# EAGLE schematic footprints (EAGLE 9.6.2)
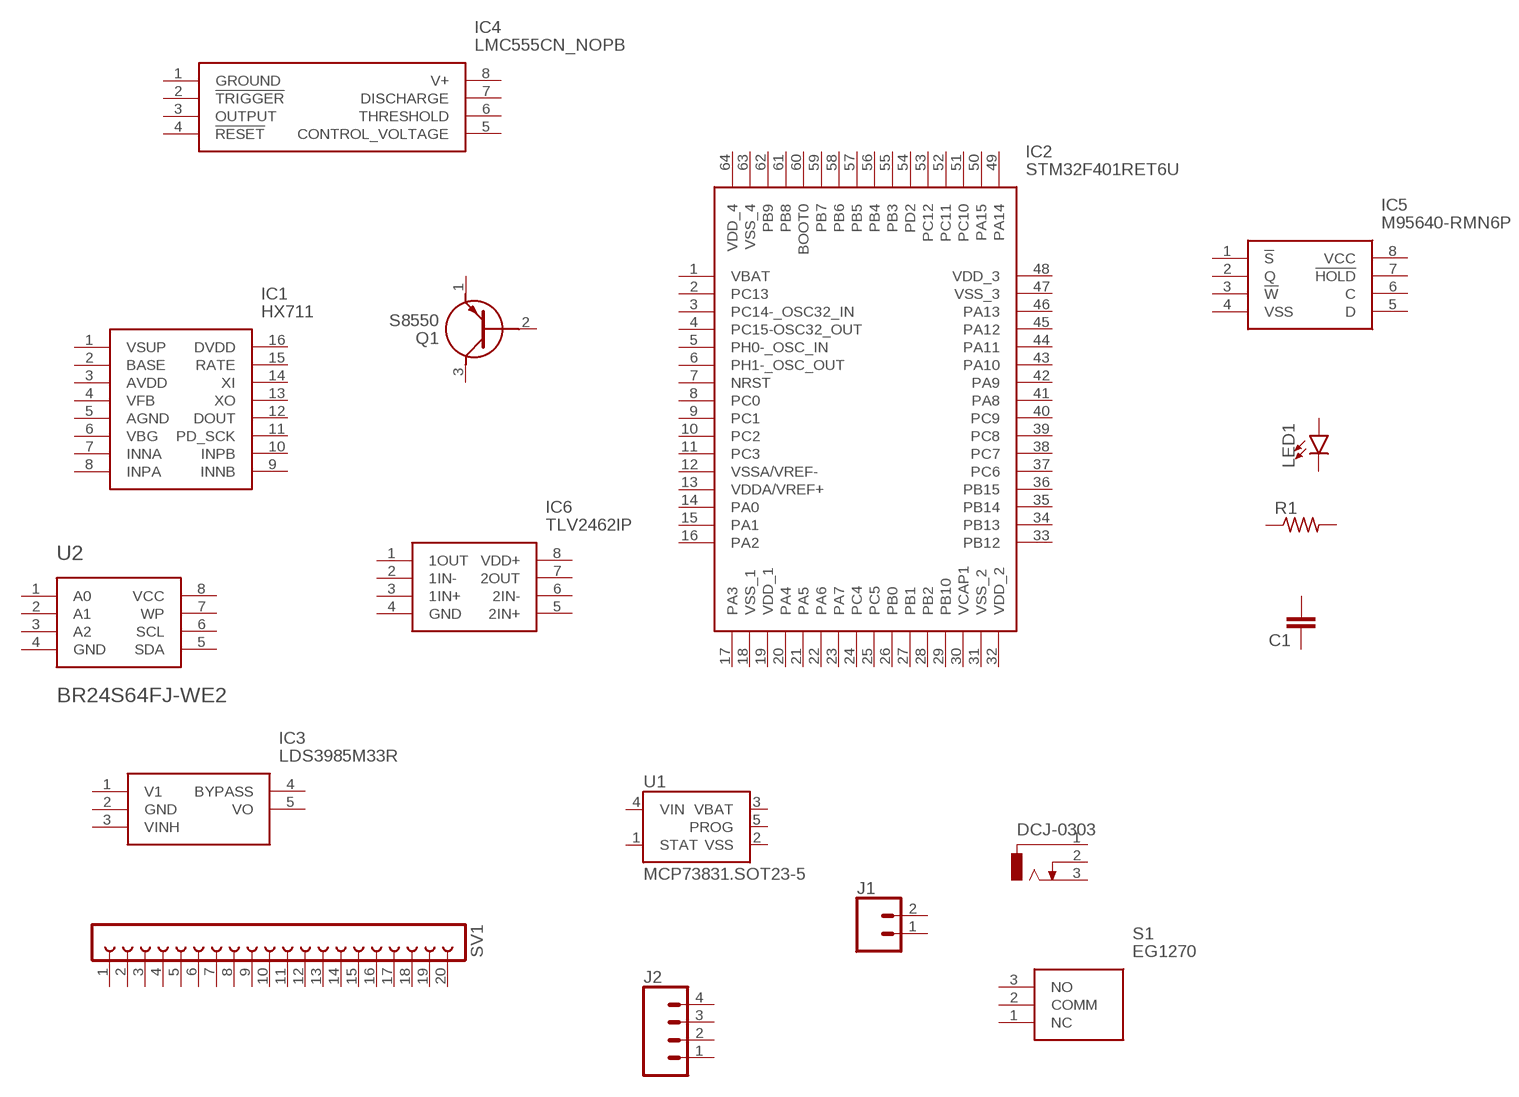
[diagram p0: schematic, sheet 1]

## Parts
C1  CAPACITOR0603  [C0603]
DCJ-0303  DCJ0303  [DCJ0303]
IC1  HX711  [SOIC127P600X160-16N]
IC2  STM32F401RET6U  [QFP50P1200X1200X160-64N]
IC3  LDS3985M33R  [SOT95P280X145-5N]
IC4  LMC555CN_NOPB  [DIP794W53P254L959H508Q8N]
IC5  M95640-RMN6P  [SOIC127P600X175-8N]
IC6  TLV2462IP  [DIP794W53P254L959H508Q8N]
J1  CONN_02  [1X02]
J2  CONN_04  [1X04]
LED1  LED0603  [LED-0603]
Q1  S8550  [MJE13001TP]
R1  RESISTOR0603  [R0603]
S1  EG1270  [EG1270]
SV1  FE20-1  [FE20]
U1  MCP73831.SOT23-5  [SOT23-5]
U2  BR24S64FJ-WE2  [SOIC8]
Unconnected: C1.1 C1.2 DCJ-0303.1 DCJ-0303.2 DCJ-0303.3 IC1.1(VSUP) IC1.2(BASE) IC1.3(AVDD) IC1.4(VFB) IC1.5(AGND) IC1.6(VBG) IC1.7(INNA) IC1.8(INPA) IC1.9(INNB) IC1.10(INPB) IC1.11(PD_SCK) IC1.12(DOUT) IC1.13(XO) IC1.14(XI) IC1.15(RATE) IC1.16(DVDD) IC2.1(VBAT) IC2.2(PC13) IC2.3(PC14-_OSC32_IN) IC2.4(PC15-OSC32_OUT) IC2.5(PH0-_OSC_IN) IC2.6(PH1-_OSC_OUT) IC2.7(NRST) IC2.8(PC0) IC2.9(PC1) IC2.10(PC2) IC2.11(PC3) IC2.12(VSSA/VREF-) IC2.13(VDDA/VREF+) IC2.14(PA0) IC2.15(PA1) IC2.16(PA2) IC2.17(PA3) IC2.18(VSS_1) IC2.19(VDD_1) IC2.20(PA4) IC2.21(PA5) IC2.22(PA6) IC2.23(PA7) IC2.24(PC4) IC2.25(PC5) IC2.26(PB0) IC2.27(PB1) IC2.28(PB2) IC2.29(PB10) IC2.30(VCAP1) IC2.31(VSS_2) IC2.32(VDD_2) IC2.33(PB12) IC2.34(PB13) IC2.35(PB14) IC2.36(PB15) IC2.37(PC6) IC2.38(PC7) IC2.39(PC8) IC2.40(PC9) IC2.41(PA8) IC2.42(PA9) IC2.43(PA10) IC2.44(PA11) IC2.45(PA12) IC2.46(PA13) IC2.47(VSS_3) IC2.48(VDD_3) IC2.49(PA14) IC2.50(PA15) IC2.51(PC10) IC2.52(PC11) IC2.53(PC12) IC2.54(PD2) IC2.55(PB3) IC2.56(PB4) IC2.57(PB5) IC2.58(PB6) IC2.59(PB7) IC2.60(BOOT0) IC2.61(PB8) IC2.62(PB9) IC2.63(VSS_4) IC2.64(VDD_4) IC3.1(V1) IC3.2(GND) IC3.3(VINH) IC3.4(BYPASS) IC3.5(VO) IC4.1(GROUND) IC4.2(!TRIGGER) IC4.3(OUTPUT) IC4.4(!RESET) IC4.5(CONTROL_VOLTAGE) IC4.6(THRESHOLD) IC4.7(DISCHARGE) IC4.8(V+) IC5.1(!S) IC5.2(Q) IC5.3(!W) IC5.4(VSS) IC5.5(D) IC5.6(C) IC5.7(!HOLD) IC5.8(VCC) IC6.1(1OUT) IC6.2(1IN-) IC6.3(1IN+) IC6.4(GND) IC6.5(2IN+) IC6.6(2IN-) IC6.7(2OUT) IC6.8(VDD+) J1.1 J1.2 J2.1 J2.2 J2.3 J2.4 LED1.A LED1.C Q1.1(E) Q1.2(B) Q1.3(C) R1.1 R1.2 S1.1(NC) S1.2(COMM) S1.3(NO) SV1.1 SV1.2 SV1.3 SV1.4 SV1.5 SV1.6 SV1.7 SV1.8 SV1.9 SV1.10 SV1.11 SV1.12 SV1.13 SV1.14 SV1.15 SV1.16 SV1.17 SV1.18 SV1.19 SV1.20 U1.1(STAT) U1.5(PROG) U2.1(A0) U2.2(A1) U2.3(A2) U2.5(SDA) U2.6(SCL) U2.7(WP)

## Power pins joined to a net without a drawn wire
GND: U2.4(GND)
VBAT: U1.3(VBAT)
VCC: U2.8(VCC)
VIN: U1.4(VIN)
VSS: U1.2(VSS)

## Library data of the parts
C1 = LinnesLab-Passives:CAPACITOR
DCJ-0303 = con-jack:DCJ0303: DC POWER JACK Source: DCJ0303.pdf; OC_FARNELL: unknown; OC_NEWARK: unknown
IC1 = SamacSys_Parts:HX711: 24-Bit Analog-to-Digital Converter (ADC) for Weigh Scale Source: Datasheet <https://cdn.sparkfun.com/datasheets/Sensors/ForceFlex/hx711_english.pdf>; DESCRIPTION: 24-Bit Analog-to-Digital Converter (ADC) for Weigh Scale; HEIGHT: 1.6mm; MANUFACTURER_NAME: AVIA Semiconductor; MANUFACTURER_PART_NUMBER: HX711
IC2 = SamacSys_Parts:STM32F401RET6U: STMICROELECTRONICS - STM32F401RET6U - MCU, 32BIT, CORTEX-M4, 84MHZ, LQFP-64 Source: Datasheet <https://www.st.com/resource/en/datasheet/stm32f401re.pdf>; DESCRIPTION: STMICROELECTRONICS - STM32F401RET6U - MCU, 32BIT, CORTEX-M4, 84MHZ, LQFP-64; HEIGHT: 1.6mm; MANUFACTURER_NAME: STMicroelectronics; MANUFACTURER_PART_NUMBER: STM32F401RET6U; MOUSER_PART_NUMBER: 511-STM32F401RET6U; MOUSER_PRICE-STOCK: https://www.mouser.co.uk/ProductDetail/STMicroelectronics/STM32F401RET6U?qs=9MuLHSklicoIHeb2rbkFrA%3D%3D
IC3 = SamacSys_Parts:LDS3985M33R: STMicroelectronics LDS3985M33R, Single Low Dropout Voltage Regulator, 300mA 3.3 V, 5-Pin SOT-23 Source: Datasheet <https://componentsearchengine.com/Datasheets/1/LDS3985M33R.pdf>; ARROW_PART_NUMBER: LDS3985M33R; ARROW_PRICE-STOCK: https://www.arrow.com/en/products/lds3985m33r/stmicroelectronics?region=nac; DESCRIPTION: STMicroelectronics LDS3985M33R, Single Low Dropout Voltage Regulator, 300mA 3.3 V, 5-Pin SOT-23; HEIGHT: 1.45mm; MANUFACTURER_NAME: STMicroelectronics; MANUFACTURER_PART_NUMBER: LDS3985M33R; MOUSER_PART_NUMBER: 511-LDS3985M33R; MOUSER_PRICE-STOCK: https://www.mouser.co.uk/ProductDetail/STMicroelectronics/LDS3985M33R?qs=DcAdhm6iCnom47SfkNYeVw%3D%3D
IC4 = SamacSys_Parts:LMC555CN_NOPB: Worlds smallest 555 timer with low power, high accuracy and a Fmax of 3MHz Source: Datasheet <http://www.ti.com/lit/ml/mpdi001b/mpdi001b.pdf>; ARROW_PART_NUMBER: LMC555CN/NOPB; ARROW_PRICE-STOCK: https://www.arrow.com/en/products/lmc555cnnopb/texas-instruments?region=nac; DESCRIPTION: Worlds smallest 555 timer with low power, high accuracy and a Fmax of 3MHz; HEIGHT: 5.08mm; MANUFACTURER_NAME: Texas Instruments; MANUFACTURER_PART_NUMBER: LMC555CN/NOPB; MOUSER_PART_NUMBER: 926-LMC555CN/NOPB; MOUSER_PRICE-STOCK: https://www.mouser.co.uk/ProductDetail/Texas-Instruments/LMC555CN-NOPB?qs=QbsRYf82W3EQl9UPdxXg8w%3D%3D
IC5 = SamacSys_Parts:M95640-RMN6P: EEPROM 32 Kbit and 64 Kbit serial SPI bus EE Source: Datasheet <https://www.st.com/content/ccc/resource/technical/document/datasheet/4b/e9/91/0c/24/94/4c/dc/CD00258834.pdf/files/CD00258834.pdf/jcr:content/translations/en.CD00258834.pdf>; ARROW_PART_NUMBER: M95640-RMN6P; ARROW_PRICE-STOCK: https://www.arrow.com/en/products/m95640-rmn6p/stmicroelectronics; DESCRIPTION: EEPROM 32 Kbit and 64 Kbit serial SPI bus EE; HEIGHT: 1.75mm; MANUFACTURER_NAME: STMicroelectronics; MANUFACTURER_PART_NUMBER: M95640-RMN6P; MOUSER_PART_NUMBER: 511-M95640-RMN6P; MOUSER_PRICE-STOCK: https://www.mouser.co.uk/ProductDetail/STMicroelectronics/M95640-RMN6P?qs=5J552fbOmopwPAu3WAPVrw%3D%3D
IC6 = SamacSys_Parts:TLV2462IP: Dual Low-Power, Rail-to-Rail Input/Output Operational Amplifier Source: Datasheet <http://www.ti.com/lit/gpn/tlv2462>; ARROW_PART_NUMBER: TLV2462IP; ARROW_PRICE-STOCK: https://www.arrow.com/en/products/tlv2462ip/texas-instruments; DESCRIPTION: Dual Low-Power, Rail-to-Rail Input/Output Operational Amplifier; HEIGHT: 5.08mm; MANUFACTURER_NAME: Texas Instruments; MANUFACTURER_PART_NUMBER: TLV2462IP; MOUSER_PART_NUMBER: 595-TLV2462IP; MOUSER_PRICE-STOCK: https://www.mouser.co.uk/ProductDetail/Texas-Instruments/TLV2462IP?qs=0le1rQK8zxo1BiHyPl8Tnw%3D%3D
J1 = LinnesLab-Connectors:CONN_02: Multi connection point. Often used as Generic Header-pin footprint for 0.1 inch spaced/style header connections On any of the 0.1 inch spaced packages, you can populate with these: Break Away Headers - Straight <https://www.sparkfun.com/products/116> (PRT-00116) Break Away Male Headers - Right Angle <https://www.sparkfun.com/products/553> (PRT-00553) Female Headers <https://www.sparkfun.com/products/115> (PRT-00115) Break Away Headers - Machine Pin <https://www.sparkfun.com/products/117> (PRT-00117) Break Away Female Headers - Swiss Machine Pin <https://www.sparkfun.com/products/743> (PRT-00743) For SCREWTERMINALS and SPRING TERMINALS visit here: Screw Terimnals on SparkFun.com <https://www.sparkfun.com/search/results?term=Screw+Terminals> (5mm/3.5mm/2.54mm spacing) This device is also useful as a general connection point to wire up your design to another part of your project. Our various solder wires solder well into these plated through hole pads. Hook-Up Wire - Assortment (Stranded, 22 AWG) <https://www.sparkfun.com/products/11375> (PRT-11375) Hook-Up Wire - Assortment (Solid Core, 22 AWG) <https://www.sparkfun.com/products/11367> (PRT-11367) View the entire wire category on our website here <https://www.sparkfun.com/categories/141> Special notes: Molex polarized connector foot print use with: PRT-08233 with associated crimp pins and housings. 2.54_SCREWTERM for use with PRT-10571. 3.5mm Screw Terminal footprints for PRT-08084 5mm Screw Terminal footprints for use with PRT-08432
J2 = LinnesLab-Connectors:CONN_04: Multi connection point. Often used as Generic Header-pin footprint for 0.1 inch spaced/style header connections On any of the 0.1 inch spaced packages, you can populate with these: Break Away Headers - Straight <https://www.sparkfun.com/products/116> (PRT-00116) Break Away Male Headers - Right Angle <https://www.sparkfun.com/products/553> (PRT-00553) Female Headers <https://www.sparkfun.com/products/115> (PRT-00115) Break Away Headers - Machine Pin <https://www.sparkfun.com/products/117> (PRT-00117) Break Away Female Headers - Swiss Machine Pin <https://www.sparkfun.com/products/743> (PRT-00743) For SCREWTERMINALS and SPRING TERMINALS visit here: Screw Terimnals on SparkFun.com <https://www.sparkfun.com/search/results?term=Screw+Terminals> (5mm/3.5mm/2.54mm spacing) This device is also useful as a general connection point to wire up your design to another part of your project. Our various solder wires solder well into these plated through hole pads. Hook-Up Wire - Assortment (Stranded, 22 AWG) <https://www.sparkfun.com/products/11375> (PRT-11375) Hook-Up Wire - Assortment (Solid Core, 22 AWG) <https://www.sparkfun.com/products/11367> (PRT-11367) View the entire wire category on our website here <https://www.sparkfun.com/categories/141> Special notes: Molex polarized connector foot print use with SKU : PRT-08231 with associated crimp pins and housings. 1MM SMD Version SKU: PRT-10208; PROD_ID: CONN-09696
LED1 = LinnesLab-LED:LED: LED (Generic) Standard schematic elements and footprints for 5mm, 3mm, 1206, and 0603 sized LEDs. Generic LEDs with no color specified. LTST-C190KGKT: arrow indicates cathode
Q1 = SamacSys_Parts:S8550: PNP Silicon Transistors Source: Datasheet; DESCRIPTION: PNP Silicon Transistors; HEIGHT: mm; MANUFACTURER_NAME: MCC(Micro Commercial Components); MANUFACTURER_PART_NUMBER: S8550
R1 = LinnesLab-Passives:RESISTOR
S1 = SamacSys_Parts:EG1270: E-SWITCH - EG1270 - SWITCH, SLIDE, SPDT, 300mA, 6V, PCB Source: Datasheet <https://componentsearchengine.com/Datasheets/1/EG1270.pdf>; DESCRIPTION: E-SWITCH - EG1270 - SWITCH, SLIDE, SPDT, 300mA, 6V, PCB; HEIGHT: 4.6mm; MANUFACTURER_NAME: E-Switch; MANUFACTURER_PART_NUMBER: EG1270; MOUSER_PART_NUMBER: 612-EG1270; MOUSER_PRICE-STOCK: https://www.mouser.co.uk/ProductDetail/E-Switch/EG1270?qs=xDsBkp9LkodMM2ilVTltow%3D%3D
SV1 = con-lsta:FE20-1: FEMALE HEADER; OC_FARNELL: unknown; OC_NEWARK: unknown
U1 = LinnesLab-Power:MCP73831
U2 = I2C-EEPROM:BR24S64FJ-WE2: 64Kbit size EEPROM using the I2C protocol for communication